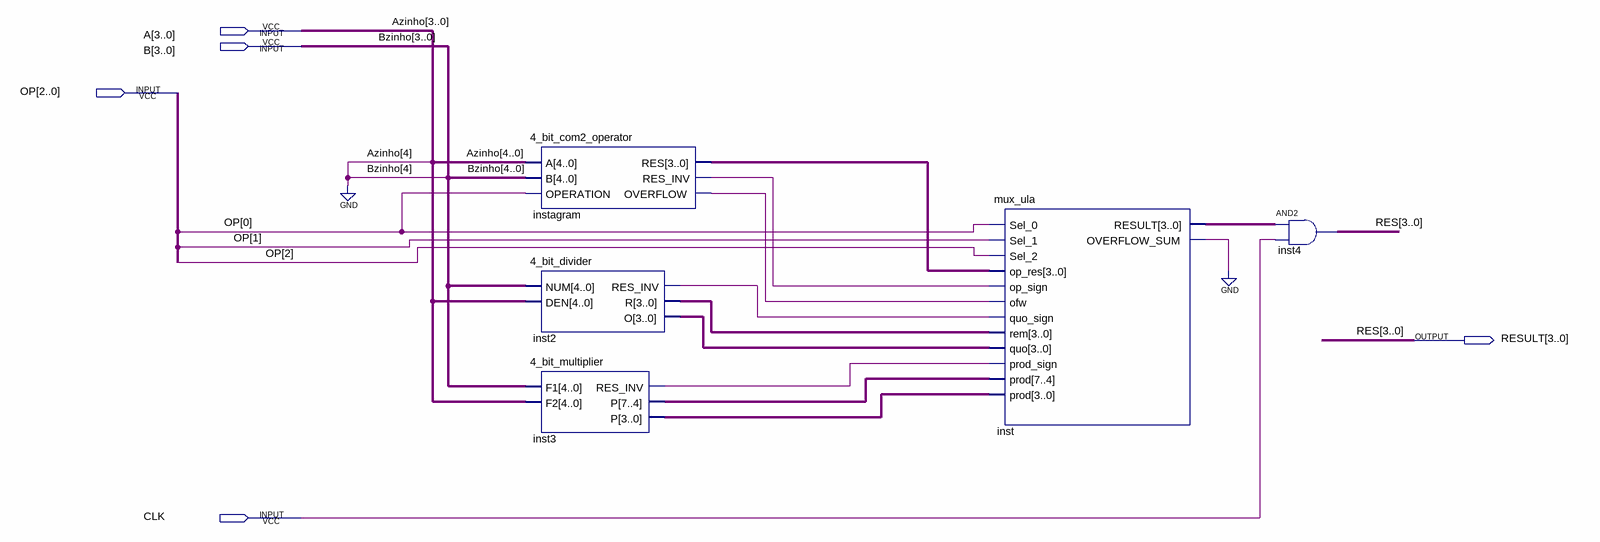
[diagram p0: schematic sheet]
// Quartus schematic alu_components.bdf as structural Verilog: 5 symbols, 5 pins
module alu_components (
  input  [3:0] A,
  input  [3:0] B,
  input  [2:0] OP,
  input  CLK,
  output [3:0] RESULT
);

  wire inst2_res_inv, inst3_res_inv, inst_overflow_sum, instagram_overflow, instagram_res_inv;
  wire [3:0] inst2_o, inst2_r, inst3_p, inst3_p_2, inst_result, instagram_res;

  \4_bit_com2_operator  instagram (
    .A({1'b0, A}), .B({1'b0, B}), .OPERATION(OP[0]), .RES(instagram_res), .RES_INV(instagram_res_inv),
    .OVERFLOW(instagram_overflow));
  \4_bit_divider  inst2 (.NUM({1'b0, B}), .DEN({1'b0, A}), .RES_INV(inst2_res_inv), .R(inst2_r), .O(inst2_o));
  \4_bit_multiplier  inst3 (.F1({1'b0, B}), .F2({1'b0, A}), .RES_INV(inst3_res_inv), .P({inst3_p, inst3_p_2}));
  mux_ula inst (
    .Sel_0(OP[0]), .Sel_1(OP[1]), .Sel_2(OP[2]), .op_res(instagram_res), .op_sign(instagram_res_inv),
    .ofw(instagram_overflow), .quo_sign(inst2_res_inv), .rem(inst2_r), .quo(inst2_o),
    .prod_sign(inst3_res_inv), .prod({inst3_p, inst3_p_2}), .RESULT(inst_result),
    .OVERFLOW_SUM(inst_overflow_sum));
  assign RESULT = inst_result & {4{CLK}};  // AND2 inst4, 4 bits wide
  // also tied to GND on the sheet: inst_overflow_sum

  // Other names for the same wires on the sheet: Azinho[3:0] = A; Bzinho[3:0] = B; RES[3:0] = RESULT
endmodule
